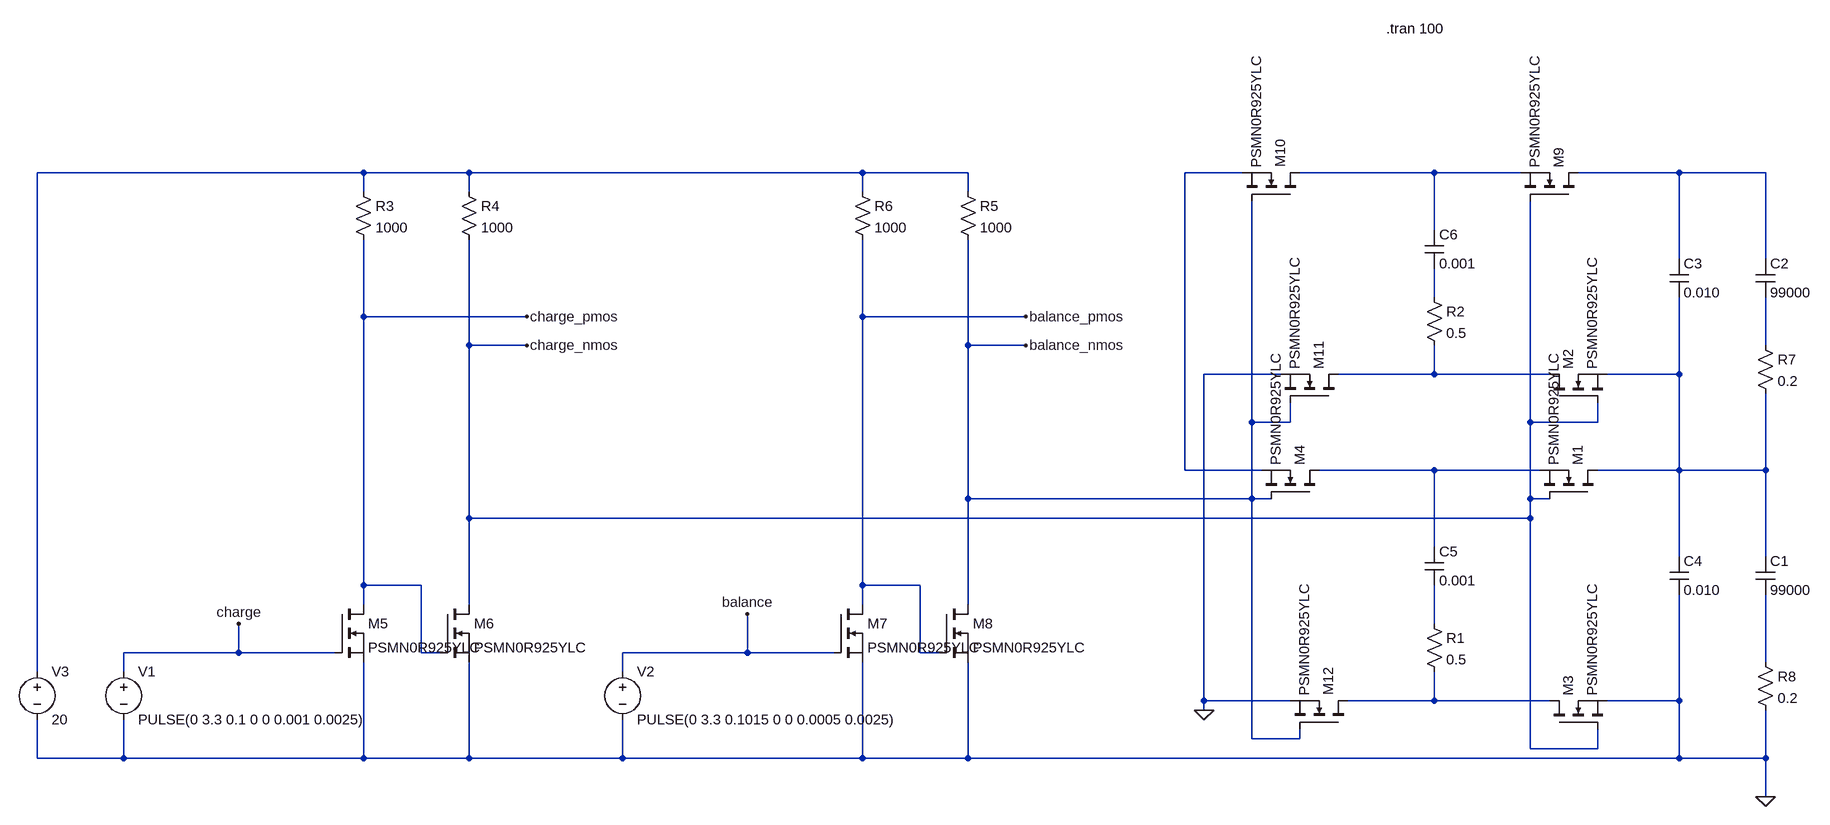
[diagram p0: schematic balance_fets.asc]
balance_fets.asc, the LTspice schematic file:
Version 4
SHEET 1 1156 772
WIRE -3456 -560 -4000 -560
WIRE -3280 -560 -3456 -560
WIRE -2624 -560 -3280 -560
WIRE -2448 -560 -2624 -560
WIRE -1424 -560 -1520 -560
WIRE -1104 -560 -1328 -560
WIRE -960 -560 -1104 -560
WIRE -656 -560 -864 -560
WIRE -512 -560 -656 -560
WIRE -3456 -528 -3456 -560
WIRE -3280 -528 -3280 -560
WIRE -2624 -528 -2624 -560
WIRE -2448 -528 -2448 -560
WIRE -1104 -464 -1104 -560
WIRE -656 -416 -656 -560
WIRE -512 -416 -512 -560
WIRE -1104 -352 -1104 -400
WIRE -3456 -320 -3456 -448
WIRE -3184 -320 -3456 -320
WIRE -2624 -320 -2624 -448
WIRE -2352 -320 -2624 -320
WIRE -3280 -272 -3280 -448
WIRE -3184 -272 -3280 -272
WIRE -2448 -272 -2448 -448
WIRE -2352 -272 -2448 -272
WIRE -512 -272 -512 -352
WIRE -1360 -224 -1488 -224
WIRE -1104 -224 -1104 -272
WIRE -1104 -224 -1264 -224
WIRE -912 -224 -1104 -224
WIRE -656 -224 -656 -352
WIRE -656 -224 -816 -224
WIRE -1408 -144 -1408 -512
WIRE -1344 -144 -1344 -176
WIRE -1344 -144 -1408 -144
WIRE -944 -144 -944 -512
WIRE -832 -144 -832 -176
WIRE -832 -144 -944 -144
WIRE -1520 -64 -1520 -560
WIRE -1392 -64 -1520 -64
WIRE -1104 -64 -1296 -64
WIRE -928 -64 -1104 -64
WIRE -656 -64 -656 -224
WIRE -656 -64 -832 -64
WIRE -512 -64 -512 -192
WIRE -512 -64 -656 -64
WIRE -2448 -16 -2448 -272
WIRE -1408 -16 -1408 -144
WIRE -1408 -16 -2448 -16
WIRE -1376 -16 -1408 -16
WIRE -944 -16 -944 -144
WIRE -912 -16 -944 -16
WIRE -3280 16 -3280 -272
WIRE -944 16 -944 -16
WIRE -944 16 -3280 16
WIRE -1104 64 -1104 -64
WIRE -656 80 -656 -64
WIRE -512 80 -512 -64
WIRE -3456 128 -3456 -320
WIRE -3360 128 -3456 128
WIRE -2624 128 -2624 -320
WIRE -2528 128 -2624 128
WIRE -3456 160 -3456 128
WIRE -3280 160 -3280 16
WIRE -2624 160 -2624 128
WIRE -2448 160 -2448 -16
WIRE -1104 192 -1104 128
WIRE -3664 240 -3664 192
WIRE -3664 240 -3856 240
WIRE -3504 240 -3664 240
WIRE -3360 240 -3360 128
WIRE -3328 240 -3360 240
WIRE -2816 240 -2816 176
WIRE -2816 240 -3024 240
WIRE -2672 240 -2816 240
WIRE -2528 240 -2528 128
WIRE -2496 240 -2528 240
WIRE -512 256 -512 144
WIRE -4000 272 -4000 -560
WIRE -3856 272 -3856 240
WIRE -3024 272 -3024 240
WIRE -1488 320 -1488 -224
WIRE -1344 320 -1488 320
WIRE -1104 320 -1104 272
WIRE -1104 320 -1248 320
WIRE -912 320 -1104 320
WIRE -656 320 -656 144
WIRE -656 320 -816 320
WIRE -1488 336 -1488 320
WIRE -1408 384 -1408 -16
WIRE -1328 384 -1328 368
WIRE -1328 384 -1408 384
WIRE -944 400 -944 16
WIRE -832 400 -832 368
WIRE -832 400 -944 400
WIRE -4000 416 -4000 352
WIRE -3856 416 -3856 352
WIRE -3856 416 -4000 416
WIRE -3456 416 -3456 256
WIRE -3456 416 -3856 416
WIRE -3280 416 -3280 256
WIRE -3280 416 -3456 416
WIRE -3024 416 -3024 352
WIRE -3024 416 -3280 416
WIRE -2624 416 -2624 256
WIRE -2624 416 -3024 416
WIRE -2448 416 -2448 256
WIRE -2448 416 -2624 416
WIRE -656 416 -656 320
WIRE -656 416 -2448 416
WIRE -512 416 -512 336
WIRE -512 416 -656 416
WIRE -512 480 -512 416
FLAG -512 480 0
FLAG -3184 -320 charge_pmos
FLAG -3184 -272 charge_nmos
FLAG -2352 -320 balance_pmos
FLAG -2352 -272 balance_nmos
FLAG -1488 336 0
FLAG -3664 192 charge
FLAG -2816 176 balance
SYMBOL cap -528 -416 R0
SYMATTR InstName C2
SYMATTR Value 99000
SYMATTR SpiceLine IC=3.3
SYMBOL cap -528 80 R0
SYMATTR InstName C1
SYMATTR Value 99000
SYMATTR SpiceLine IC=3.2
SYMBOL voltage -4000 256 R0
WINDOW 123 0 0 Left 0
WINDOW 39 0 0 Left 0
SYMATTR InstName V3
SYMATTR Value 20
SYMBOL cap -672 -416 R0
SYMATTR InstName C3
SYMATTR Value 0.010
SYMBOL cap -672 80 R0
SYMATTR InstName C4
SYMATTR Value 0.010
SYMBOL cap -1120 64 R0
SYMATTR InstName C5
SYMATTR Value 0.001
SYMBOL res -1120 176 R0
SYMATTR InstName R1
SYMATTR Value 0.5
SYMBOL cap -1120 -464 R0
SYMATTR InstName C6
SYMATTR Value 0.001
SYMBOL res -1120 -368 R0
SYMATTR InstName R2
SYMATTR Value 0.5
SYMBOL voltage -3856 256 R0
WINDOW 123 0 0 Left 0
WINDOW 39 0 0 Left 0
SYMATTR InstName V1
SYMATTR Value PULSE(0 3.3 0.1 0 0 0.001 0.0025)
SYMBOL nmos -3504 160 R0
SYMATTR InstName M5
SYMATTR Value PSMN0R925YLC
SYMBOL nmos -3328 160 R0
SYMATTR InstName M6
SYMATTR Value PSMN0R925YLC
SYMBOL res -3296 -544 R0
SYMATTR InstName R4
SYMATTR Value 1000
SYMBOL res -3472 -544 R0
SYMATTR InstName R3
SYMATTR Value 1000
SYMBOL voltage -3024 256 R0
WINDOW 123 0 0 Left 0
WINDOW 39 0 0 Left 0
SYMATTR InstName V2
SYMATTR Value PULSE(0 3.3 0.1015 0 0 0.0005 0.0025)
SYMBOL nmos -2672 160 R0
SYMATTR InstName M7
SYMATTR Value PSMN0R925YLC
SYMBOL nmos -2496 160 R0
SYMATTR InstName M8
SYMATTR Value PSMN0R925YLC
SYMBOL res -2464 -544 R0
SYMATTR InstName R5
SYMATTR Value 1000
SYMBOL res -2640 -544 R0
SYMATTR InstName R6
SYMATTR Value 1000
SYMBOL nmos -1264 -176 M270
SYMATTR InstName M11
SYMATTR Value PSMN0R925YLC
SYMBOL nmos -1248 368 M270
SYMATTR InstName M12
SYMATTR Value PSMN0R925YLC
SYMBOL res -528 -288 R0
SYMATTR InstName R7
SYMATTR Value 0.2
SYMBOL res -528 240 R0
SYMATTR InstName R8
SYMATTR Value 0.2
SYMBOL nmos -1296 -16 M270
SYMATTR InstName M4
SYMATTR Value PSMN0R925YLC
SYMBOL nmos -864 -512 M270
SYMATTR InstName M9
SYMATTR Value PSMN0R925YLC
SYMBOL nmos -1328 -512 M270
SYMATTR InstName M10
SYMATTR Value PSMN0R925YLC
SYMBOL nmos -832 -16 M270
SYMATTR InstName M1
SYMATTR Value PSMN0R925YLC
SYMBOL nmos -912 -176 R270
SYMATTR InstName M2
SYMATTR Value PSMN0R925YLC
SYMBOL nmos -912 368 R270
SYMATTR InstName M3
SYMATTR Value PSMN0R925YLC
TEXT -1184 -800 Left 2 !.tran 100

The netlist it stands for:
* balance_fets.asc
C2 N004 N006 99000 IC=3.3
C1 N008 N011 99000 IC=3.2
V3 N001 0 20
C3 N004 N008 0.010
C4 N008 0 0.010
C5 N009 N010 0.001
R1 N010 N012 0.5
C6 N003 N005 0.001
R2 N005 N007 0.5
V1 charge 0 PULSE(0 3.3 0.1 0 0 0.001 0.0025)
M5 charge_pmos charge 0 0 PSMN0R925YLC
M6 charge_nmos charge_pmos 0 0 PSMN0R925YLC
R4 N001 charge_nmos 1000
R3 N001 charge_pmos 1000
V2 balance 0 PULSE(0 3.3 0.1015 0 0 0.0005 0.0025)
M7 balance_pmos balance 0 0 PSMN0R925YLC
M8 balance_nmos balance_pmos 0 0 PSMN0R925YLC
R5 N001 balance_nmos 1000
R6 N001 balance_pmos 1000
M11 N007 balance_nmos 0 0 PSMN0R925YLC
M12 N012 balance_nmos 0 0 PSMN0R925YLC
R7 N006 N008 0.2
R8 N011 0 0.2
M4 N009 balance_nmos N002 N002 PSMN0R925YLC
M9 N004 charge_nmos N003 N003 PSMN0R925YLC
M10 N003 balance_nmos N002 N002 PSMN0R925YLC
M1 N008 charge_nmos N009 N009 PSMN0R925YLC
M2 N007 charge_nmos N008 N008 PSMN0R925YLC
M3 N012 charge_nmos 0 0 PSMN0R925YLC
.model NMOS NMOS
.model PMOS PMOS
.lib standard.mos
.tran 100
.backanno
.end